# EasyEDA schematic Aquarium_Schematic.json
TITLE: Aquarium; REV: 2.0; Date: 2019-12-29; Sheet: 1/1; Drawn By: Stefan Burkhardt; Company: Private
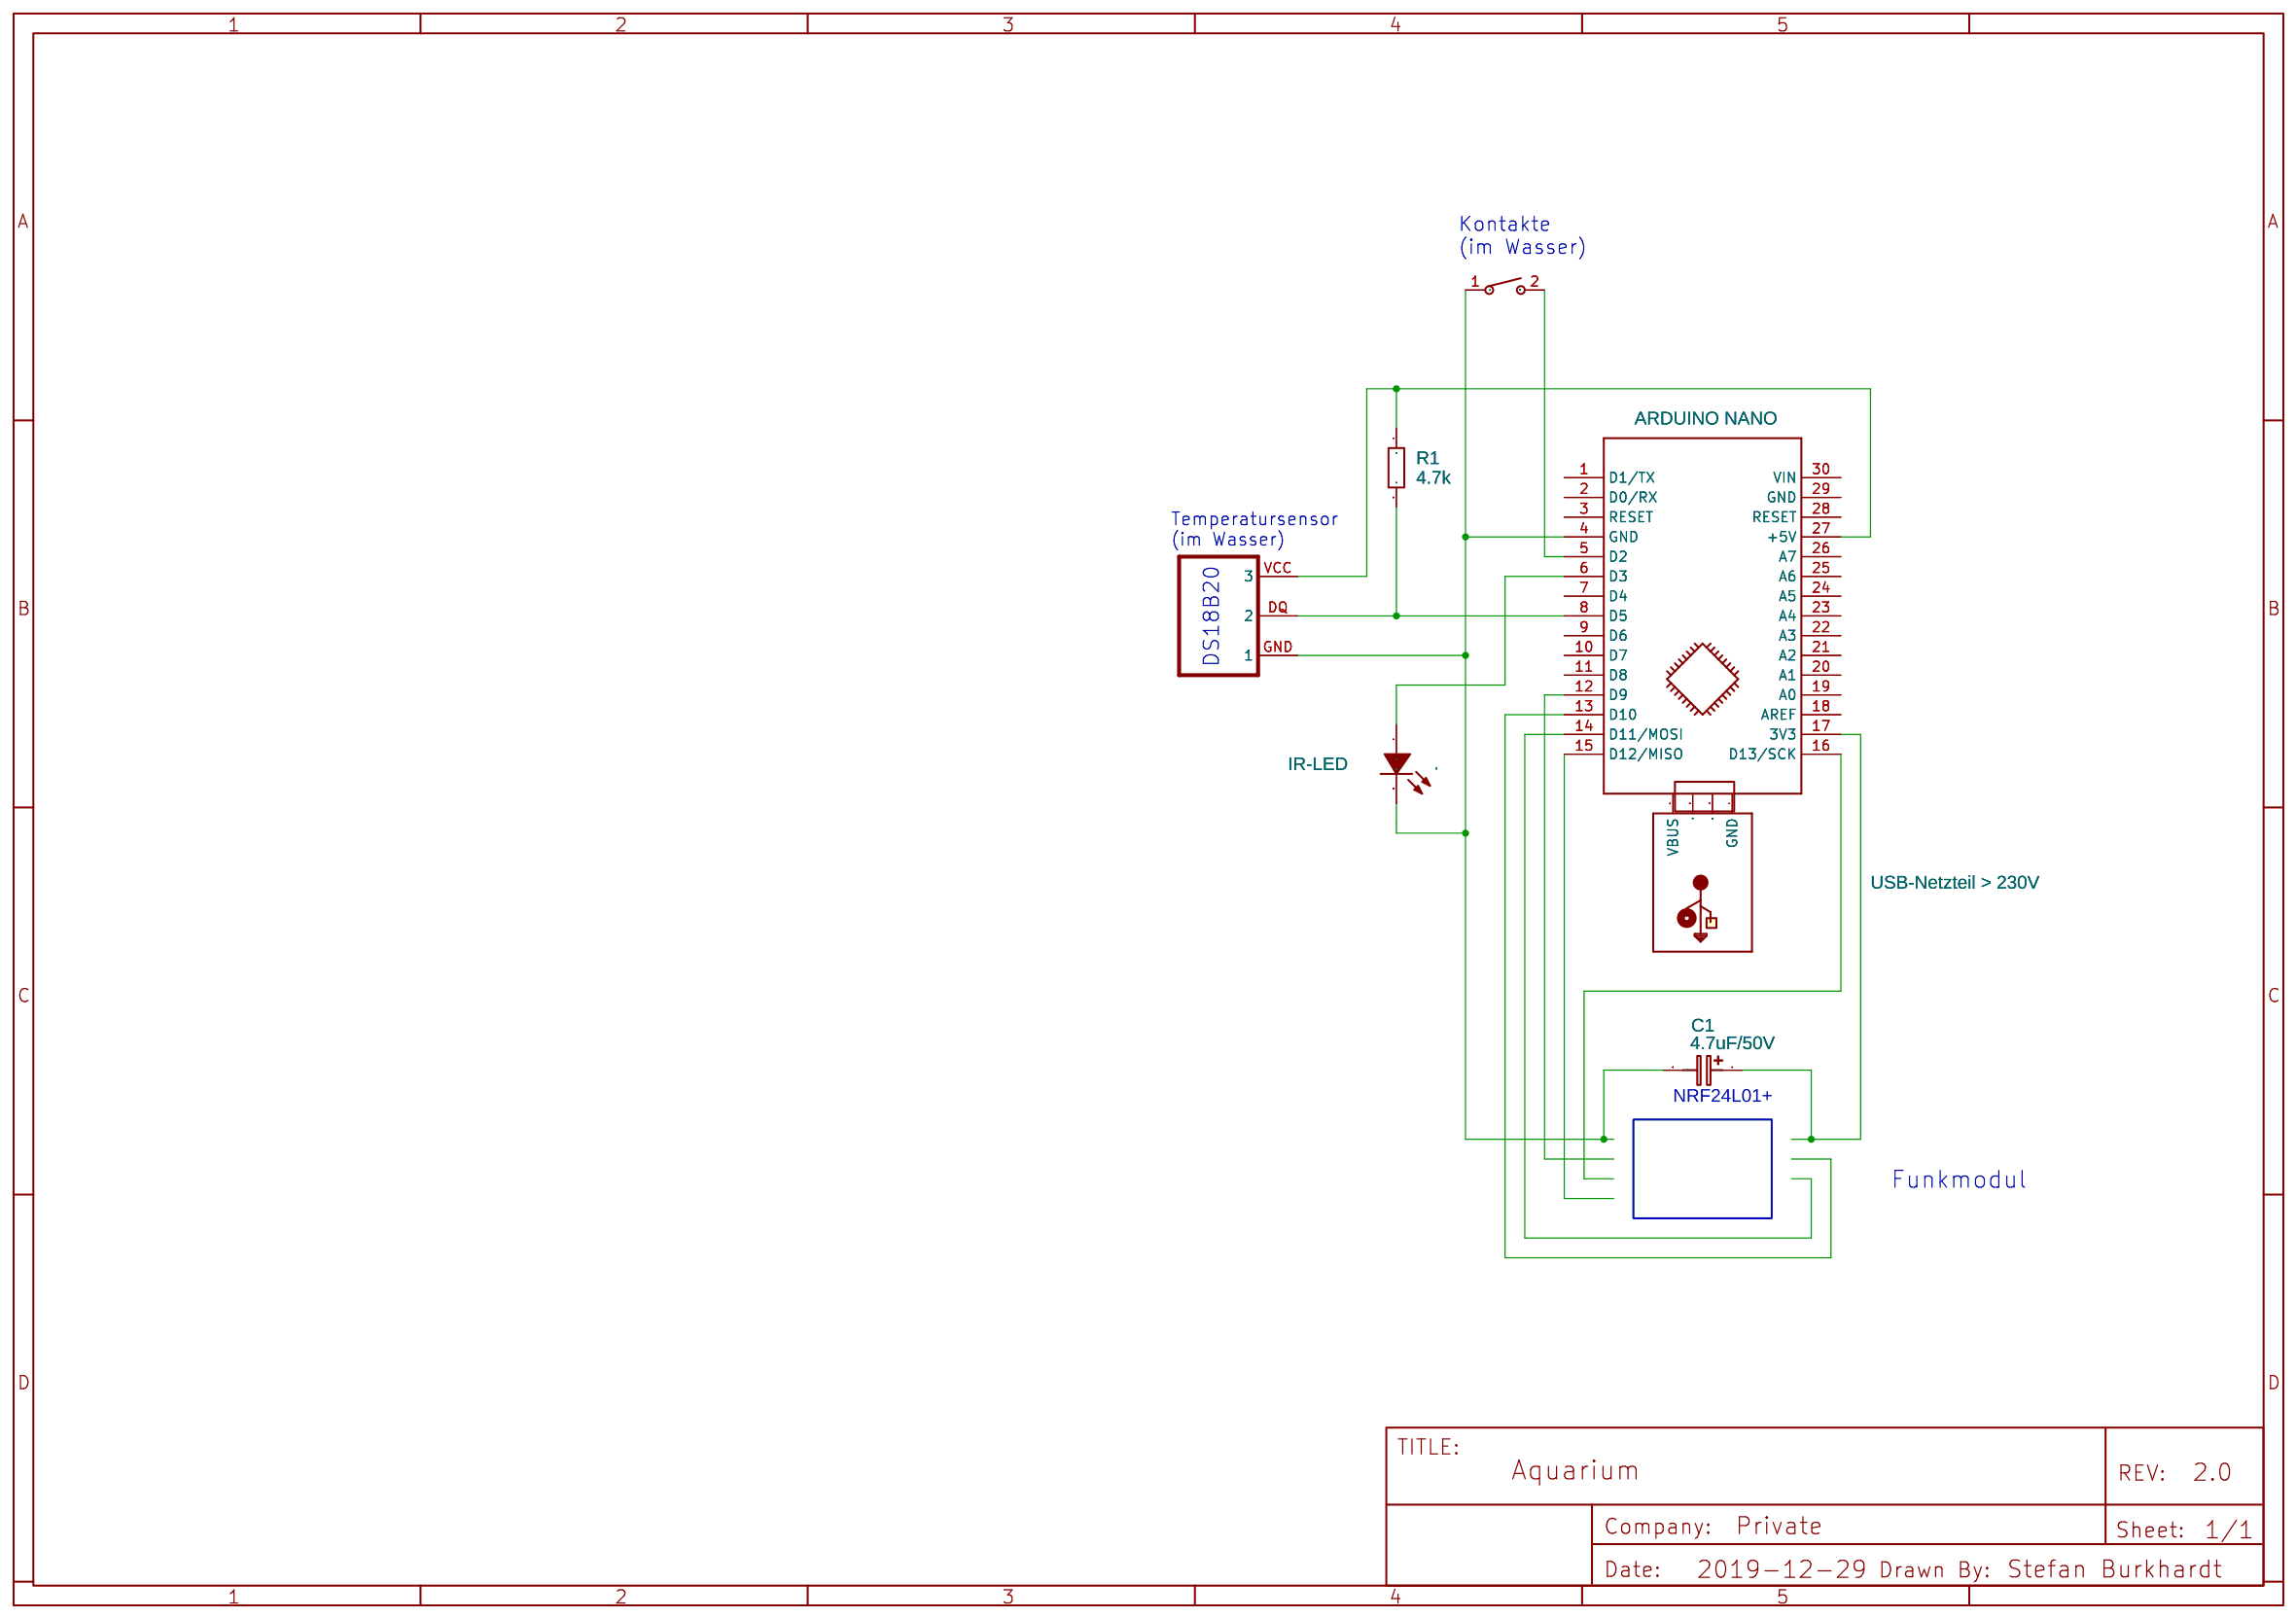
[diagram p0: schematic sheet]

## Parts
.  IR-LED  [LED-3MM/2.54]
C1  4.7uF/50V  [CAP-D3.0XF1.5]
R1  4.7k  [AXIAL-0.3]
SW1  Wasser-Kurzschluss  [K2-1107ST-A4SW-06]
U1  ARDUINO NANO  [ARDUINO_NANO]
U2  DS18B20  [DIP]
X1  USB-Netzteil > 230V  [MOLEX_480371000]

## Library data of the parts
. = -: Supplier: LCSC; Manufacturer: EVERLIGHT; Manufacturer Part: 204-10SURD/S530-A3; Supplier Part: C99772
C1 = Cap_Electrolytic(TH)_D3.0XF1.5_EU: Contributor: EasyEDA; Manufacturer Part: ?
R1 = Res_AXIAL-0.3(1/8W)_EU: Manufacturer Part: ?
SW1 = -: Supplier: LCSC; Supplier Part: C118141; Manufacturer: Rectangular Connectors - Contacts; Contributor: LCSC
U1 = -: sourceId: KGSeAWhDB; Manufacturer Part: ?
U2 = -: Contributor: HGY; Manufacturer Part: ?
X1 = -: Contributor: Adafruit; Manufacturer Part: ?

## Nets
Net-(.-1): ..1(A) U1.6(D3)
Net-(.-2): ..2(K) C1.2 SW1.1 U1.4(GND) U2.GND(1)
Net-(C1-1): C1.1 U1.17(3V3)
Net-(R1-1): R1.1 U1.27(+5V) U2.VCC(3)
Net-(R1-2): R1.2 U1.8(D5) U2.DQ(2)
Net-(SW1-2): SW1.2 U1.5(D2)

Not connected (* = marked no-connect by the designer): U1 1(D1/TX) 2(D0/RX) 3(RESET) 7(D4) 9(D6) 10(D7) 11(D8) 12(D9) 13(D10) 14(D11/MOSI) 15(D12/MISO) 16(D13/SCK) 18(AREF) 19(A0) 20(A1) 21(A2) 22(A3) 23(A4) 24(A5) 25(A6) 26(A7) 28(RESET) 29(GND) 30(VIN); X1 1(VBUS) 2(D-) 3(D+) 4(GND)

## Notes on the sheet
- Kontakte
  (im Wasser)
- Temperatursensor
  (im Wasser)
- DS18B20
- NRF24L01+
- Funkmodul
